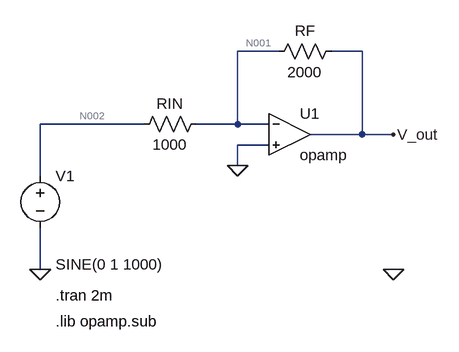
[diagram p0: schematic noninvert_prelab.asc]
noninvert_prelab.asc, the LTspice schematic file:
Version 4
SHEET 1 880 680
WIRE 288 16 224 16
WIRE 416 16 368 16
WIRE 80 128 -80 128
WIRE 224 128 224 16
WIRE 224 128 160 128
WIRE 272 128 224 128
WIRE 416 144 416 16
WIRE 416 144 336 144
WIRE 464 144 416 144
WIRE 272 160 224 160
WIRE 224 192 224 160
WIRE -80 208 -80 128
WIRE -80 352 -80 288
FLAG -80 352 0
FLAG 464 352 0
FLAG 224 192 0
FLAG 464 144 V_out
SYMBOL res 176 112 R90
WINDOW 0 0 56 VBottom 2
WINDOW 3 32 56 VTop 2
SYMATTR InstName RIN
SYMATTR Value 1000
SYMBOL res 384 0 R90
WINDOW 0 0 56 VBottom 2
WINDOW 3 32 56 VTop 2
SYMATTR InstName RF
SYMATTR Value 2000
SYMBOL Opamps\\opamp 304 80 R0
SYMATTR InstName U1
SYMBOL voltage -80 192 R0
WINDOW 3 24 152 Left 2
WINDOW 123 24 124 Left 2
WINDOW 39 0 0 Left 0
SYMATTR InstName V1
SYMATTR Value SINE(0 1 1000)
TEXT -56 392 Left 2 !.tran 2m
TEXT -56 432 Left 2 !.lib opamp.sub

The netlist it stands for:
* noninvert_prelab.asc
RIN N001 N002 1000
RF V_out N001 2000
XU1 N001 0 V_out opamp Aol=100K GBW=10Meg  ; pins invin noninvin out
V1 N002 0 SINE(0 1 1000)
.tran 2m
.lib opamp.sub
.backanno
.end

* Results of the author's LTspice run, read from the files saved beside the schematic
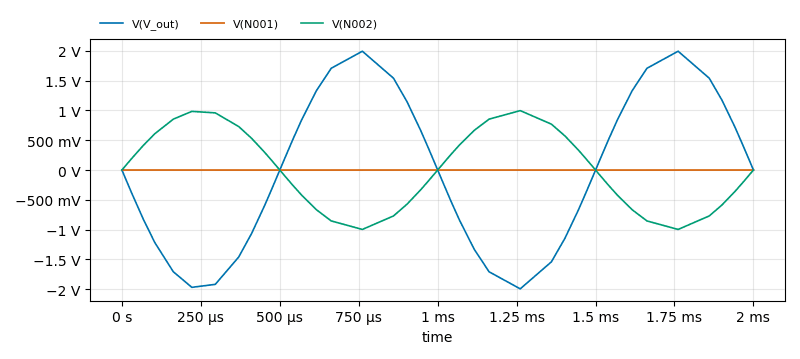
[diagram p1: Transient Analysis of noninvert_prelab.asc, plotted from the saved traces]
* Transient Analysis, 1 run:
*   V(V_out): min -1.993 V, max 1.993 V, average -2.765 mV, rms 1.392 V, last 600 µV
*   V(N001): min -200.9 µV, max 201.1 µV, average 19.57 nV, rms 144.3 µV, last 200 µV
*   V(N002): min -996.5 mV, max 996.5 mV, average 1.383 mV, rms 695.9 mV, last 0 V